# Altium schematic sheet MOSFET_Switch_Parallel.SchDoc
size A4
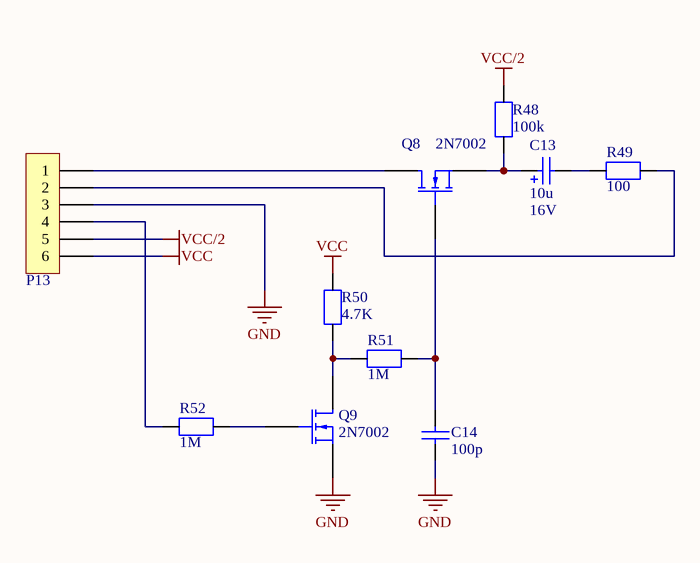
[diagram p0: MOSFET_Switch_Parallel.SchDoc]

## Parts
C13  value 10u  Initial Voltage: 16V  [ELEC_RAD10]  (hidden comment: Electrolytic Capacitor)
C14  value 100p  [0805_Capacitor]  (hidden comment: Capacitor)
P13  SIL-CONN-6  [SIL-CONN-6-R2]  (value not drawn)
Q8  2N7002  [SOT23-3]
Q9  2N7002  [SOT23-3]
R48  value 100k  [0805_Resistor]  (hidden comment: Resistor)
R49  value 100  [0805_Resistor]  (hidden comment: Resistor)
R50  value 4.7K  [0805_Resistor]  (hidden comment: Resistor)
R51  value 1M  [0805_Resistor]  (hidden comment: Resistor)
R52  value 1M  [0805_Resistor]  (hidden comment: Resistor)

## Nets
GND: C14.1 P13.3 Q9.S
VCC: P13.6 R50.2
VCC/2: P13.5 R48.2
NetC13_+: C13.+ Q8.S R48.1
NetC13_-: C13.- R49.1
NetC14_2: C14.2 Q8.G R51.2
NetP13_1: P13.1 Q8.D
NetP13_2: P13.2 R49.2
NetP13_4: P13.4 R52.2
NetQ9_D: Q9.D R50.1 R51.1
NetQ9_G: Q9.G R52.1

## Library data of the parts
Q8 Q9 = 2N7002: pin to pad: D>1 G>2 S>3